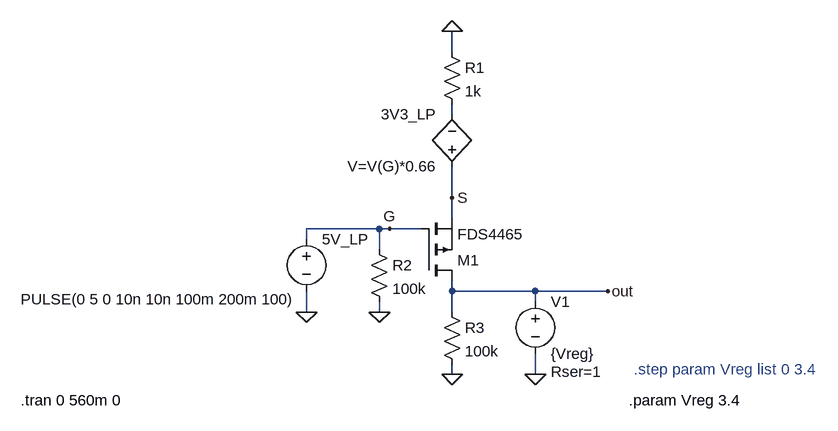
[diagram p0: schematic BackCurrent_PMOS_sim.asc]
BackCurrent_PMOS_sim.asc, the LTspice schematic file:
Version 4
SHEET 1 2036 680
WIRE 864 0 864 -32
WIRE 864 96 864 80
WIRE 864 224 864 176
WIRE 864 256 864 224
WIRE 752 272 640 272
WIRE 768 272 752 272
WIRE 816 272 768 272
WIRE 640 288 640 272
WIRE 752 304 752 272
WIRE 864 368 864 352
WIRE 992 368 864 368
WIRE 1104 368 992 368
WIRE 992 384 992 368
WIRE 640 400 640 368
WIRE 752 400 752 384
WIRE 864 400 864 368
WIRE 864 496 864 480
WIRE 992 496 992 464
FLAG 640 400 0
FLAG 992 496 0
FLAG 864 224 S
FLAG 768 272 G
FLAG 864 -32 0
FLAG 752 400 0
FLAG 1104 368 out
FLAG 864 496 0
SYMBOL pmos 816 352 M180
SYMATTR InstName M1
SYMATTR Value FDS4465
SYMBOL voltage 640 272 R0
WINDOW 3 -440 108 Left 2
WINDOW 123 0 0 Left 2
WINDOW 39 0 0 Left 2
SYMATTR Value PULSE(0 5 0 10n 10n 100m 200m 100)
SYMATTR InstName 5V_LP
SYMBOL bv 864 192 R180
WINDOW 0 24 96 Left 2
WINDOW 3 24 16 Left 2
SYMATTR InstName 3V3_LP
SYMATTR Value V=V(G)*0.66
SYMBOL res 848 -16 R0
SYMATTR InstName R1
SYMATTR Value 1k
SYMBOL res 736 288 R0
SYMATTR InstName R2
SYMATTR Value 100k
SYMBOL res 848 384 R0
SYMATTR InstName R3
SYMATTR Value 100k
SYMBOL voltage 992 368 R0
WINDOW 123 0 0 Left 2
WINDOW 39 24 124 Left 2
SYMATTR SpiceLine Rser=1
SYMATTR InstName V1
SYMATTR Value {Vreg}
TEXT 200 536 Left 2 !.tran 0 560m 0
TEXT 1144 488 Left 2 ;.step param Vreg list 0 3.4
TEXT 1136 536 Left 2 !.param Vreg 3.4

The netlist it stands for:
* BackCurrent_PMOS_sim.asc
M1 out G S S FDS4465
V§5V_LP G 0 PULSE(0 5 0 10n 10n 100m 200m 100)
B§3V3_LP S N001 V=V(G)*0.66
R1 0 N001 1k
R2 G 0 100k
R3 out 0 100k
V1 out 0 {Vreg} Rser=1
.model NMOS NMOS
.model PMOS PMOS
.lib standard.mos
.tran 0 560m 0
* .step param Vreg list 0 3.4
.param Vreg 3.4
.backanno
.end